# EAGLE design VOC_Interface (EAGLE 7.5.0)
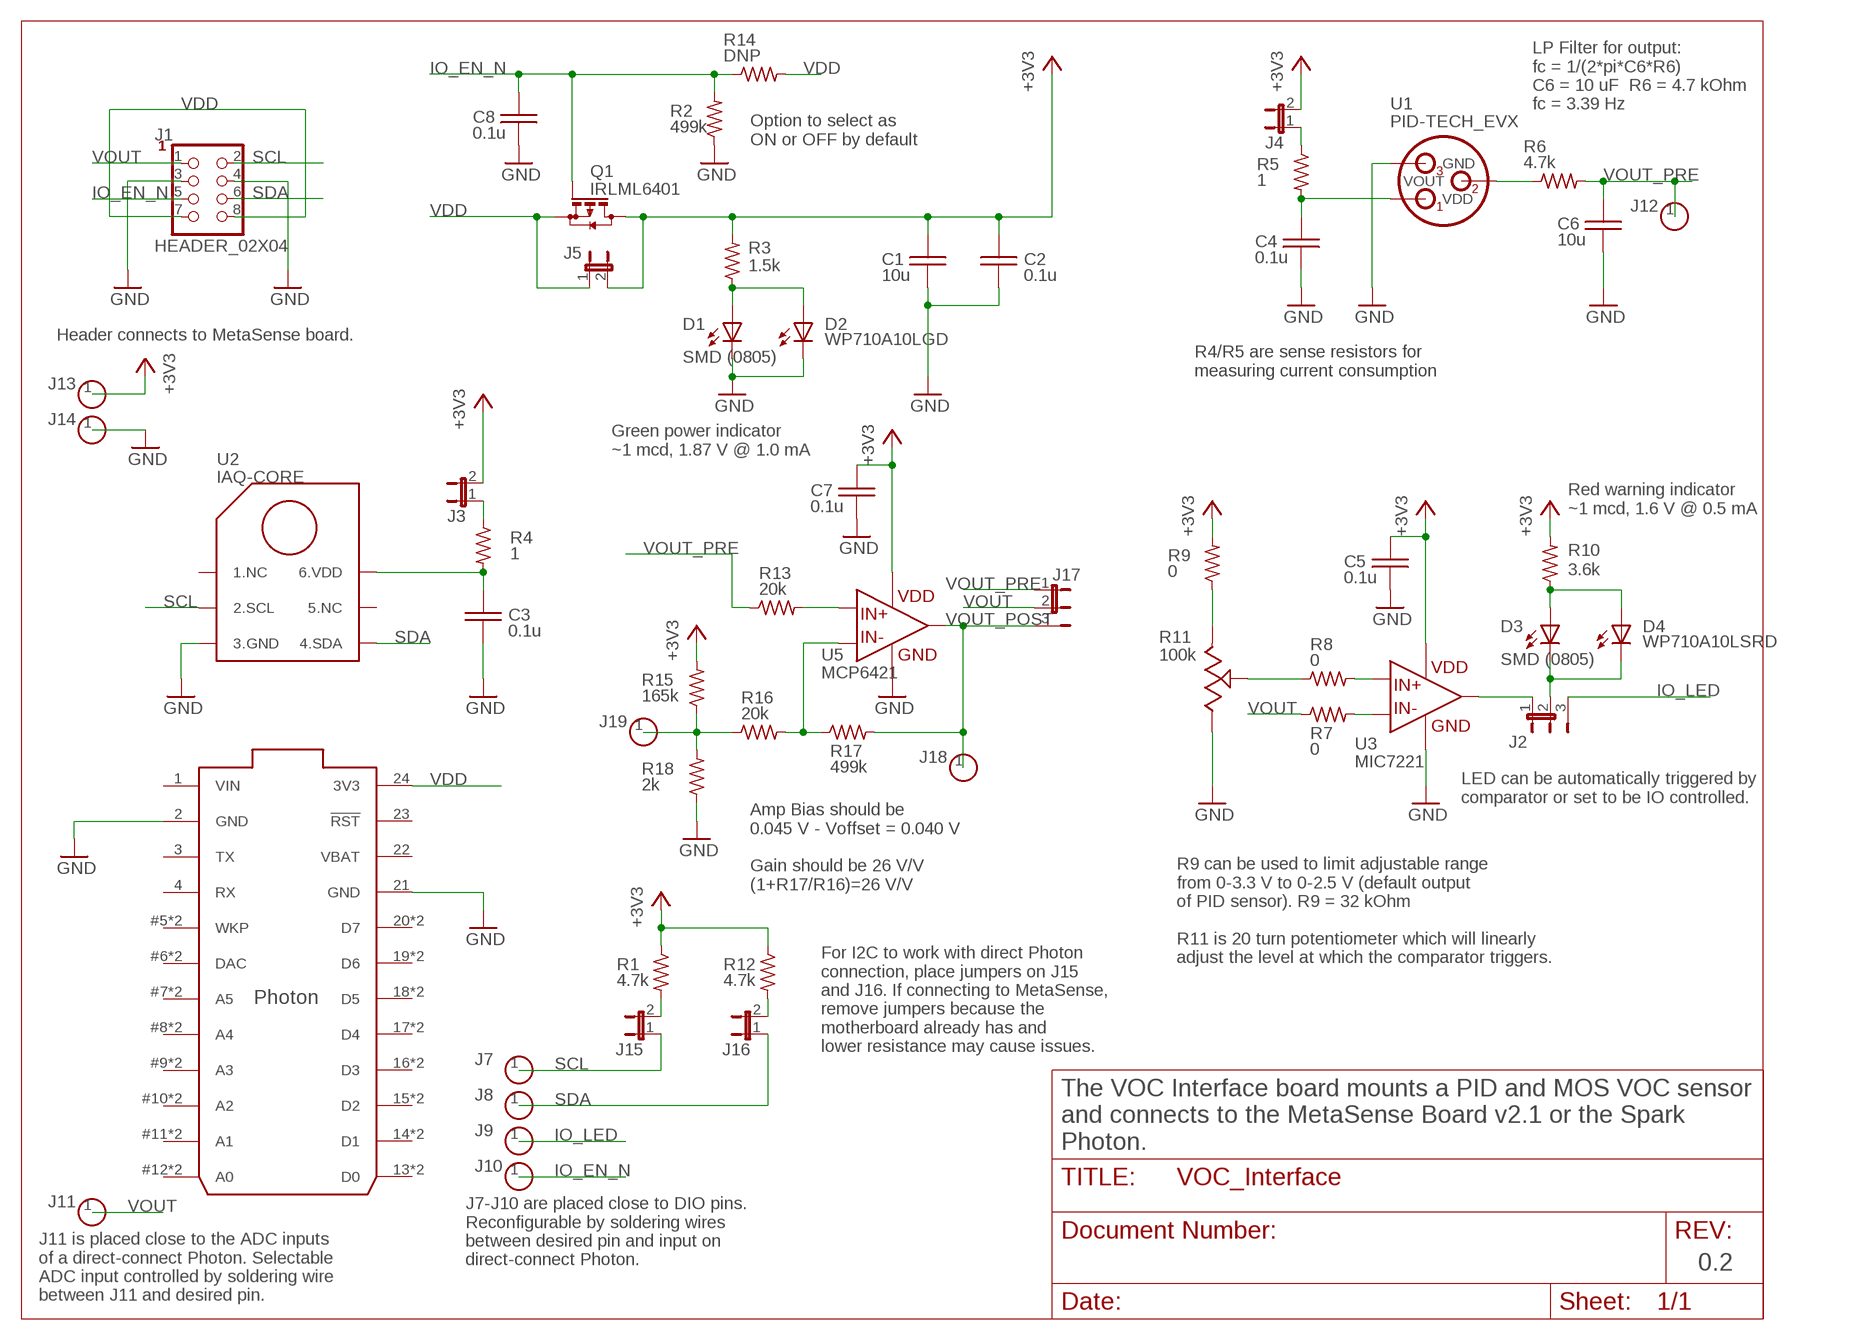
[diagram p0: schematic, sheet 1]

## Parts
C1  10u  C0805  [C0805]
C2  0.1u  C0805  [C0805]
C3  0.1u  C0805  [C0805]
C4  0.1u  C0805  [C0805]
C5  0.1u  C0805  [C0805]
C6  10u  C0805  [C0805]
C7  0.1u  C0805  [C0805]
C8  0.1u  C0805  [C0805]
D1  SMD (0805)  LEDSMD_0805  [CHIPLED_0805]
D2  WP710A10LGD  LEDTH_3MM  [LED3MM]
D3  SMD (0805)  LEDSMD_0805  [CHIPLED_0805]
D4  WP710A10LSRD  LEDTH_3MM  [LED3MM]
J1  HEADER_02X04  [2X04]
J2  HEADER_01X03  [1X03]
J3  HEADER_01X02  [1X02]
J4  HEADER_01X02  [1X02]
J5  HEADER_01X02  [1X02]
J7  HEADER_01X01  [1X01]
J8  HEADER_01X01  [1X01]
J9  HEADER_01X01  [1X01]
J10  HEADER_01X01  [1X01]
J11  HEADER_01X01  [1X01]
J12  HEADER_01X01  [1X01]
J13  HEADER_01X01  [1X01]
J14  HEADER_01X01  [1X01]
J15  HEADER_01X02  [1X02]
J16  HEADER_01X02  [1X02]
J17  HEADER_01X03  [1X03]
J18  HEADER_01X01  [1X01]
J19  HEADER_01X01  [1X01]
Q1  IRLML6401  BSS84  [SOT23]
R1  4.7k  R0805  [R0805]
R2  499k  R0805  [R0805]
R3  1.5k  R0805  [R0805]
R4  1  R0805  [R0805]
R5  1  R0805  [R0805]
R6  4.7k  R0805  [R0805]
R7  0  R0805  [R0805]
R8  0  R0805  [R0805]
R9  0  R0805  [R0805]
R10  3.6k  R0805  [R0805]
R11  100k  POT  [POTTRIM_TOP]
R12  4.7k  R0805  [R0805]
R13  20k  R0805  [R0805]
R14  DNP  R0805  [R0805]
R15  165k  R0805  [R0805]
R16  20k  R0805  [R0805]
R17  499k  R0805  [R0805]
R18  2k  R0805  [R0805]
U1  PID-TECH_EVX  [VOC_PID_3SOCKET]
U2  IAQ-CORE  [IAQ-CORE]
U3  MIC7221  [SOT-23-5]
U4  PHOTON  [PHOTON_STACKABLE]
U5  MCP6421  [SOT-23-5]

## Nets
+3V3: C1.2 C2.2 C5.2 C7.2 J3.2 J4.2 J5.2 J13.1 Q1.3(D) R1.1 R3.2 R9.2 R10.2 R12.1 R15.2 U3.2(2.VDD) U5.5(2.VDD)
AMP_IN+: R13.2 U5.3(3.IN+)
AMP_IN-: R16.2 R17.1 U5.4(4.IN-)
AMP_VBIAS: J19.1 R15.1 R16.1 R18.2
GND: C1.1 C2.1 C3.1 C4.1 C5.1 C6.1 C7.1 C8.1 D1.C D2.C J1.3 J1.4 J14.1 R2.1 R11.3 R18.1 U1.3_GND(GND) U2.3(3.GND) U3.5(5.GND) U4.2(GND) U4.21(GND) U5.2(5.GND)
IO_EN_N: C8.2 J1.5 J10.1 Q1.1(G) R2.2 R14.1
IO_LED: J2.3 J9.1
N$1: J2.1 U3.1(1.VOUT)
N$2: D3.C D4.C J2.2
N$4: D1.A D2.A R3.1
N$5: D3.A D4.A R10.1
N$7: R9.1 R11.1
N$8: R8.1 R11.2
N$9: J3.1 R4.1
N$10: J4.1 R5.1
N$11: J16.2 R12.2
N$13: J15.2 R1.2
N$27: R8.2 U3.3(3.IN+)
N$32: R7.2 U3.4(4.IN-)
SCL: J1.2 J7.1 J15.1 U2.2(2.SCL)
SDA: J1.6 J8.1 J16.1 U2.4(4.SDA)
VDD: J1.7 J1.8 J5.1 Q1.2(S) R14.2 U4.24(3V3)
VDD_MOS: C3.2 R4.2 U2.6(6.VDD)
VDD_PID: C4.2 R5.2 U1.1_VDD(VDD)
VOUT: J1.1 J11.1 J17.2 R7.1
VOUT_POST: J17.3 J18.1 R17.2 U5.1(1.VOUT)
VOUT_PRE: C6.2 J12.1 J17.1 R6.2 R13.1
VVOC: R6.1 U1.2_VOUT(VOUT)
Unconnected: U2.1(1.NC) U2.5(5.NC) U4.3(TX) U4.4(RX) U4.5(WKP) U4.6(DAC) U4.7(A5) U4.8(A4) U4.9(A3) U4.10(A2) U4.11(A1) U4.12(A0) U4.13(D0) U4.14(D1) U4.15(D2) U4.16(D3) U4.17(D4) U4.18(D5) U4.19(D6) U4.20(D7) U4.23(!RST) U4.#5(WKP) U4.#6(DAC) U4.#7(A5) U4.#8(A4) U4.#9(A3) U4.#10(A2) U4.#11(A1) U4.#12(A0) U4.@13(D0) U4.@14(D1) U4.@15(D2) U4.@16(D3) U4.@17(D4) U4.@18(D5) U4.@19(D6) U4.@20(D7)

## Notes on the sheet
- LP Filter for output:
  fc = 1/(2*pi*C6*R6)
  C6 = 10 uF  R6 = 4.7 kOhm
  fc = 3.39 Hz
- Option to select as 
  ON or OFF by default
- Header connects to MetaSense board.
- R4/R5 are sense resistors for 
  measuring current consumption
- Green power indicator
  ~1 mcd, 1.87 V @ 1.0 mA
- Red warning indicator
  ~1 mcd, 1.6 V @ 0.5 mA
- Amp Bias should be
  0.045 V - Voffset = 0.040 V
  
  Gain should be 26 V/V
  (1+R17/R16)=26 V/V
- LED can be automatically triggered by 
  comparator or set to be IO controlled.
- R9 can be used to limit adjustable range
  from 0-3.3 V to 0-2.5 V (default output 
  of PID sensor). R9 = 32 kOhm
  
  R11 is 20 turn potentiometer which will linearly
  adjust the level at which the comparator triggers.
- For I2C to work with direct Photon
  connection, place jumpers on J15
  and J16. If connecting to MetaSense,
  remove jumpers because the
  motherboard already has and
  lower resistance may cause issues.
- The VOC Interface board mounts a PID and MOS VOC sensor 
  and connects to the MetaSense Board v2.1 or the Spark 
  Photon.
- J7-J10 are placed close to DIO pins.
  Reconfigurable by soldering wires
  between desired pin and input on
  direct-connect Photon.
- 0.2
- J11 is placed close to the ADC inputs
  of a direct-connect Photon. Selectable
  ADC input controlled by soldering wire 
  between J11 and desired pin.

## Power pins joined to a net without a drawn wire
VBAT: U4.22(VBAT)
VIN: U4.1(VIN)

## Library data of the parts
C1-C8 = SEELAB:C
D1-D4 = SEELAB:LED
J1 = SEELAB:HEADER_02X04
J2 J17 = SEELAB:HEADER_01X03
J3-J5 J15 J16 = SEELAB:HEADER_01X02
J7-J14 J18 J19 = SEELAB:HEADER_01X01
Q1 = transistor-small-signal:BSS84: P-CHANNEL MOS FET
R1-R10 R12-R18 = SEELAB:R
R11 = SEELAB:POT
U1 = SEELAB:PID-TECH_EVX: PID VOC Sensor Mocon piD-TECH eVx for detecting TVOC concentration. Millmax 0363-0-15-80-23-27-10-0 mounts into holes.
U2 = SEELAB:IAQ-CORE
U3 = SEELAB:MIC7221: MIC7221 Comparator Low-cost, Rail-to-rail comparator, VDD = 2.2 - 10 V, Iq = 7 uA at VDD = 5.0 V, current sink output (> 100 mA). MIC7211 is push/pull output.
U4 = SEELAB:PHOTON
U5 = SEELAB:MCP6421

## Board
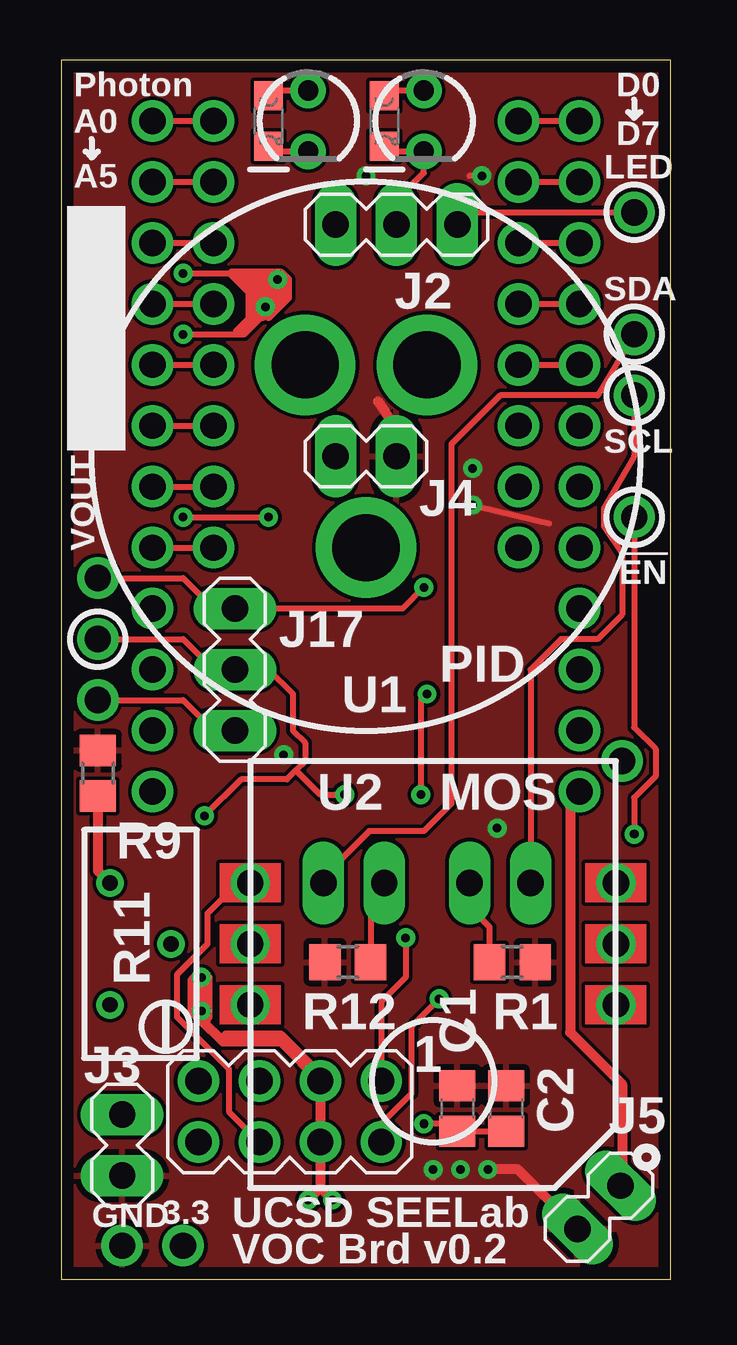
[diagram p1: board, top side]
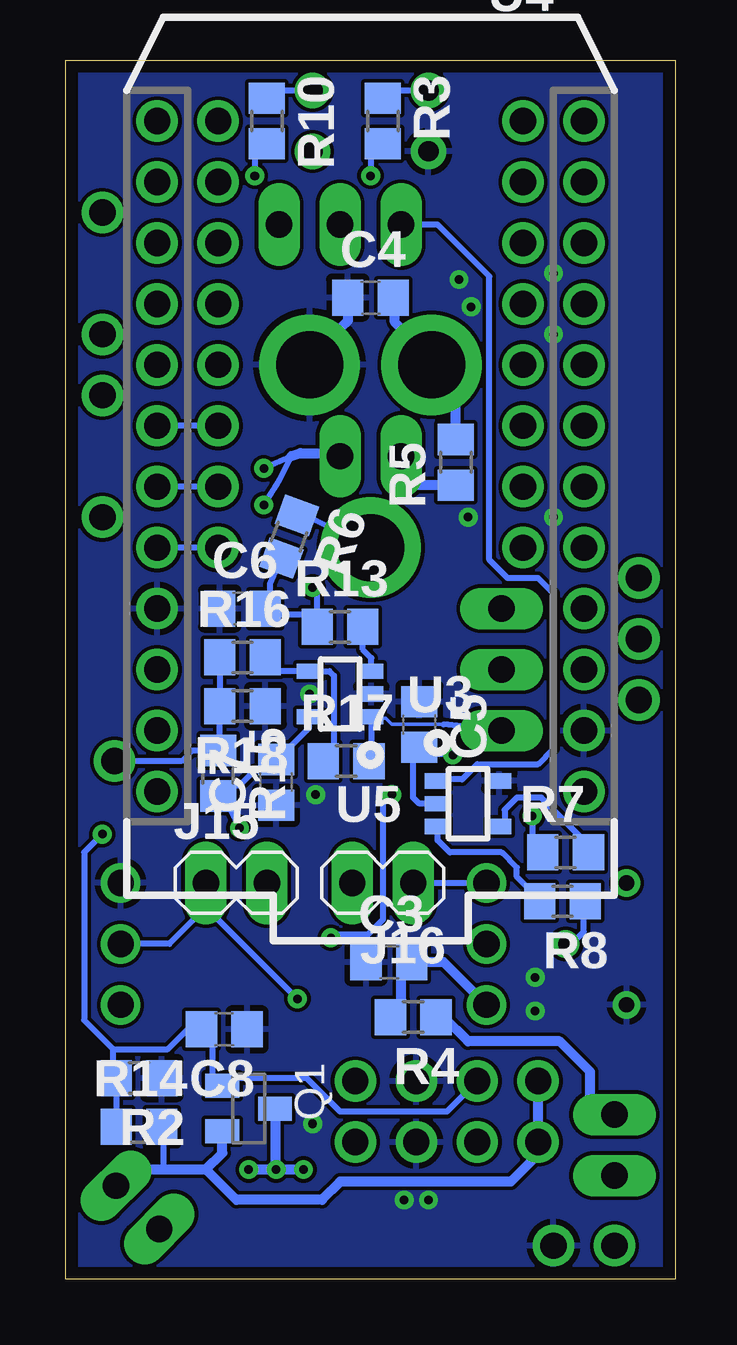
[diagram p2: board, bottom side, seen from below]

Size 25.4 x 50.8 mm. Coordinates in mm from the lower left corner, seen from the top.
Outline: 0,0 25.4,0 25.4,50.8 0,50.8 0,0
Copper layers (1*16): Top 0.0178mm / dielectric 59mil / Bottom 0.0178mm
Design rules "SSC-EAGLE-2Lyr_v1.0.0.3": minimum track width 6mil, minimum drill 14mil, track to track 6mil, track to pad 6mil, pad to pad 6mil, via to via 6mil, smd to smd 6mil, copper to edge 20mil, drill to drill 16mil, minimum pad ring 8mil, minimum via ring 8mil, stop-mask expansion 3mil, vias tented up to drill 0mil, thermal gap 10mil

### Footprints (pad centres in the part's own frame; a part is rotated, then mirrored left to right if it is on the bottom)
C0805 = smd 1.3 x 1.5: 1 -0.95,0; 2 0.95,0
CHIPLED_0805 = smd 1.2 x 1.2: A -1.05,0; C 1.05,0
LED3MM = drill 0.838 pad 1.473: A -1.27,0; C 1.27,0
2X04 = drill 1.097 pad 1.727: 1 -3.81,-1.27; 2 -3.81,1.27; 3 -1.27,-1.27; 4 -1.27,1.27; 5 1.27,-1.27; 6 1.27,1.27; 7 3.81,-1.27; 8 3.81,1.27
1X03 = drill 1.097 pad 1.727 long: 1 -2.54,0; 2 0,0; 3 2.54,0
1X02 = drill 1.097 pad 1.727 long: 1 -1.27,0; 2 1.27,0
1X01 = drill 1.097 pad 1.727: 1 0,0
SOT23 = smd 1 x 1.4: 1 -0.95,-1.1; 2 0.95,-1.1; 3 0,1.1
R0805 = smd 1.3 x 1.5: 1 -0.95,0; 2 0.95,0
POTTRIM_TOP = drill 0.635 pad 1.143: 1 1.27,-2.54; 2 -1.27,0; 3 1.27,2.54
VOC_PID_3SOCKET = drill 2.794 pad 3.81: 1_VDD -3.81,-2.54; 2_VOUT 3.81,0; 3_GND -3.81,2.54
IAQ-CORE = drill 1.092 pad 1.6: 1 -7.62,2.54; 2 -7.62,0; 3 -7.62,-2.54; 4 7.62,-2.54; 5 7.62,0; 6 7.62,2.54
SOT-23-5 = smd 0.635 x 1.016: 1 -0.95,-1.3; 2 0,-1.3; 3 0.95,-1.3; 4 0.95,1.3; 5 -0.95,1.3
PHOTON_STACKABLE = drill 1.097 pad 1.727: 1 1.27,32.258; 2 1.27,29.718; 3 1.27,27.178; 4 1.27,24.638; 5 1.27,22.098; 6 1.27,19.558; 7 1.27,17.018; 8 1.27,14.478; 9 1.27,11.938; 10 1.27,9.398; 11 1.27,6.858; 12 1.27,4.318; 13 19.05,4.318; 14 19.05,6.858; 15 19.05,9.398; 16 19.05,11.938; 17 19.05,14.478; 18 19.05,17.018; 19 19.05,19.558; 20 19.05,22.098; 21 19.05,24.638; 22 19.05,27.178; 23 19.05,29.718; 24 19.05,32.258; #5 3.81,22.098; #6 3.81,19.558; #7 3.81,17.018; #8 3.81,14.478; #9 3.81,11.938; #10 3.81,9.398; #11 3.81,6.858; #12 3.81,4.318; @13 16.51,4.318; @14 16.51,6.858; @15 16.51,9.398; @16 16.51,11.938; @17 16.51,14.478; @18 16.51,17.018; @19 16.51,19.558; @20 16.51,22.098

### Placement (x,y rotation side)
C1  16.51,7.11 90 top
C2  18.54,7.11 90 top
C3  11.94,13.21 0 bottom
C4  12.7,40.89 0 bottom
C5  10.67,23.11 270 bottom
C6  18.03,27.94 0 bottom
C7  16.64,20.7 90 bottom
C8  18.8,10.41 180 bottom
D1  8.64,48.26 270 top
D2  10.29,48.26 270 top
D3  13.46,48.26 270 top
D4  15.11,48.26 270 top
J1  9.53,6.99 180 top
J2  13.97,43.94 0 top
J3  2.54,5.59 270 top
J4  12.7,34.29 0 top
J5  22.4,3 225 top
J7  23.88,36.83 0 top
J8  23.88,39.37 0 top
J9  23.88,44.45 0 top
J10  23.88,31.75 0 top
J11  1.52,26.67 0 top
J12  1.52,29.21 0 top
J13  2.54,1.4 0 top
J14  5.08,1.4 0 top
J15  18.29,16.51 0 bottom
J16  12.19,16.51 180 bottom
J17  7.24,25.4 270 top
J18  1.52,24.13 0 top
J19  23.37,21.59 0 top
Q1  17.78,7.11 270 bottom
R1  18.8,13.21 180 top
R2  22.35,8.38 180 bottom
R3  12.19,48.26 270 bottom
R4  10.92,10.92 180 bottom
R5  9.14,34.04 90 bottom
R6  16.09,30.94 250 bottom
R7  4.57,17.78 0 bottom
R8  4.7,15.75 180 bottom
R9  1.52,21.08 90 top
R10  17.02,48.26 270 bottom
R11  3.3,13.97 180 top
R12  11.94,13.21 0 top
R13  13.97,27.18 0 bottom
R14  22.35,6.35 0 bottom
R15  19.05,21.08 270 bottom
R16  18.03,25.91 0 bottom
R17  13.72,21.59 0 bottom
R18  18.03,23.88 180 bottom
U1  12.7,34.29 270 top
U2  15.49,13.97 180 top
U3  8.64,19.81 270 bottom
U4  2.54,52.58 180 bottom
U5  13.97,24.38 90 bottom

### Tracks (layer width: path | path; a pad name or v marks a point on that pad's centre or on a via)
+3V3  (via drill 0.36 pad 0.79)
  Top 0.254: v9.27,21.84 9.14,21.72 | v17.14,32.26 20.32,31.5 | v12.7,45.97 12.45,45.97 | v17.53,45.97 17.02,45.97
  Top 0.406: v15.49,4.57 15.49,4.32 | J5.2 19.03,4.57 v17.78,4.57 | 13.21,36.58 13.72,35.81
  Bottom 0.254: 18.8,20.32 18.86,20.32 R15.2 18.54,19.62 v18.16,18.8 | 18.54,20.57 18.16,20.57 17.53,21.21 17.33,21.21 C7.2 16.83,21.4 15.27,22.96 U5.5 | v9.27,21.84 10.23,21.91 C5.2 10.92,21.91 10.92,20.07 10.67,19.81 U3.2 | 15.62,34.42 15.75,34.29 16,34.29 | R3.2 12.7,46.8 v12.7,45.97 | R10.2 17.53,47.06 v17.53,45.97 | v17.14,33.78 16,34.29 | v17.14,32.26 16.51,33.27 16,34.29
  Bottom 0.406: 18.8,20.32 18.54,20.57 | Q1.3 16.68,4.62 v16.64,4.57 | v16.64,4.57 v15.49,4.57 | v17.78,4.57 v16.64,4.57 | 16,34.29 15.62,34.42 14.1,34.42 J4.2
  pour Top: 0,50.8 25.4,50.8 25.4,0 0,0
AMP_IN+
  Bottom 0.254: U5.3 12.67,25.88 13.02,26.23 R13.2
AMP_IN-
  Bottom 0.254: R16.2 16.51,25.33 U5.4 14.41,25.33 14.22,25.15 14.22,22.03 R17.1
AMP_VBIAS
  Bottom 0.254: R16.1 R18.2 18.98,22.03 R15.1 20.13,22.03 20.57,21.59 J19.1
GND  (via drill 0.36 pad 0.79)
  Top 0.254: v5.08,41.91 7.11,41.91 8.76,41.91 v9.02,41.66 | v5.08,39.37 7.62,39.37 8.38,40.13 v8.51,40.51 | v15.11,6.48 16.32,6.48 C1.1 C2.1 | v15.24,24.38 14.99,24.13 v14.99,20.19 | D1.C 8.86,46.99 D2.C | v5.08,31.75 v8.64,31.75
  Top 0.406: 8.38,40.13 8.38,41.4 8.89,41.91 | 8.89,41.91 9.14,41.91 9.4,41.66 9.4,40.89 8.64,40.13 | 7.37,39.5 7.87,40.01 7.87,41.15 7.11,41.91 8.89,41.91 | 5.84,12.7 5.71,12.7 5.46,12.45 5.46,11.18 5.84,10.79 | 5.84,12.45 v5.84,11.18 5.84,10.79 | 5.84,10.79 6.73,9.91 9.14,9.91 J1.3 | 5.84,10.79 5.97,10.79 6.1,10.92 6.1,12.57 5.97,12.7 | 10.92,8.38 10.79,8.38 J1.4 10.79,3.81 | 10.79,3.81 v11.3,3.3 | v10.29,3.3 10.79,3.81
  Bottom 0.254: v15.11,6.48 15.11,6.22
  Bottom 0.406: C4.1 13.65,39.94 14.73,38.86 14.73,38.61 U1.3_GND
  other vias: 5.84,12.57
  pour Bottom: 0,50.8 25.4,50.8 25.4,0 0,0
IO_EN_N  (via drill 0.36 pad 0.79)
  Top 0.254: J10.1 23.88,22.99 24.77,22.1 24.77,20.95 23.88,20.07 v23.88,18.54
  Bottom 0.254: Q1.1 18.95,8.13 | Q1.1 18.73,8.06 18.41,8.38 15.37,8.38 13.97,6.99 9.53,6.99 J1.5 | Q1.1 18.98,8.06 19.3,8.38 19.3,10.23 C8.2 20.32,10.41 21.15,9.59 23.43,9.59 | v23.88,18.54 24.64,17.78 24.64,10.79 23.43,9.59 | 23.43,9.59 23.43,8.51 R2.2 R14.1
IO_LED
  Top 0.254: J2.3 17.02,44.45 J9.1
N$1
  Bottom 0.254: J2.1 9.91,43.94 7.75,41.78 7.75,29.97 6.99,29.21 5.71,29.21 5.08,28.57 5.08,22.1 5.71,21.46 8.26,21.46 8.89,20.83 9.87,20.83 U3.1
N$2
  Top 0.254: D3.C 13.68,46.99 D4.C 15.11,46.1 13.97,44.96 J2.2
N$3
  Top 0.254: 4.57,48.26 5.59,48.26
N$4
  Top 0.254: D1.A 8.86,49.53 D2.A
  Bottom 0.254: R3.1 11.87,49.53 D2.A
N$5
  Top 0.254: D3.A 13.68,49.53 D4.A
  Bottom 0.254: R10.1 16.7,49.53 D4.A
N$6
  Top 0.254: 4.57,45.72 5.59,45.72
N$7
  Top 0.406: R9.1 1.52,17.02 R11.1
N$8
  Bottom 0.254: R11.2 4.32,13.97 3.81,14.48 3.81,15.69 R8.1
N$9
  Bottom 0.406: J3.1 2.79,7.11 3.56,7.11 3.56,8.64 4.83,9.91 8.64,9.91 9.65,10.92 R4.1
N$10
  Bottom 0.406: R5.1 10.99,33.09 11.43,33.53 J4.1
N$11
  Top 0.254: J16.2 12.89,16.19 R12.2
N$12
  Top 0.254: 4.57,43.18 5.59,43.18
N$13
  Top 0.254: R1.2 17.85,14.67 17.02,15.49 J15.2
N$14
  Top 0.254: 4.57,40.64 5.59,40.64
N$15
  Top 0.254: 4.57,38.1 5.59,38.1
N$16
  Top 0.254: 4.57,35.56 5.59,35.56
N$17
  Top 0.254: 4.57,30.48 5.59,30.48
N$18
  Top 0.254: 4.57,33.02 5.59,33.02
N$19
  Top 0.254: 19.81,48.26 20.83,48.26
N$20
  Top 0.254: 19.81,45.72 20.83,45.72
N$21
  Top 0.254: 19.81,43.18 20.83,43.18
N$22
  Top 0.254: 19.81,40.64 20.83,40.64
N$23
  Top 0.254: 19.81,38.1 20.83,38.1
N$24
  Bottom 0.254: 19.81,35.56 20.83,35.56
N$25
  Bottom 0.254: 19.81,33.02 20.83,33.02
N$26
  Bottom 0.254: 19.81,30.48 20.83,30.48
N$27
  Bottom 0.254: R8.2 5.65,15.81 6.6,16.76 6.6,17.14 7.24,17.78 9.4,17.78 9.91,18.29 9.91,18.83 U3.3
N$28
  Top 0.406: 6.86,10.16 9.14,10.16 10.92,8.38
N$29
  Top 0.406: 9.14,41.66 9.14,41.15 8.64,40.64 8.64,41.15 9.02,41.53
N$30
  Top 0.406: 7.62,41.66 8.38,41.66
N$31
  Top 0.406: 7.87,41.4 8.13,41.4 8.13,40.13
N$32
  Bottom 0.254: R7.2 3.62,18.1 5.59,20.07 6.6,20.07 7.11,19.56 7.11,19.09 U3.4
SCL  (via drill 0.36 pad 0.79)
  Top 0.254: J7.1 23.88,34.29 22.61,32.13 22.61,31.37 23.37,30.23 23.37,27.69 22.35,26.67 20.83,26.67 19.56,25.4 19.56,17.78 19.43,17.4 19.43,17.14 19.56,17.02 | 19.56,17.65 19.56,17.02 | 19.56,17.02 J15.1 | J1.2 13.34,6.48 14.61,7.75 14.61,10.54 v15.75,11.68
  Bottom 0.254: J15.1 19.56,15.49 | 19.56,15.49 21.08,13.97 U2.2 | v15.75,11.68 19.56,15.49
SDA
  Top 0.254: U2.4 7.37,16.51 6.1,15.24 6.1,13.97 4.83,12.7 4.83,10.92 6.99,8.76 6.99,6.99 J1.6 | J8.1 22.35,36.83 18.29,36.83 16.26,34.8 16.26,19.81 15.11,18.67 12.83,18.67 11.43,17.27 11.43,17.02 J16.1
  Bottom 0.254: J16.1 U2.4
VDD
  Top 0.406: U4.24 21.21,19.68 21.21,10.29 23.37,8.13 23.37,3.83 J5.1
  Bottom 0.254: R14.2 21.34,6.28 21.34,4.57
  Bottom 0.406: J5.1 22.62,4.57 21.34,4.57 19.56,4.57 | 19.56,4.57 18.88,5.25 Q1.2 | 19.56,4.57 18.29,3.3 14.73,3.3 13.97,4.06 6.86,4.06 5.71,5.21 J1.8 J1.7
VDD_MOS
  Bottom 0.406: U2.6 9.65,13.21 C3.2 11.24,12.89 11.43,12.57 11.43,11.49 R4.2
VDD_PID
  Bottom 0.406: R5.2 9.14,36.58 9.65,37.08 9.65,37.59 U1.1_VDD 10.16,38.35 11.68,39.88 11.68,40.83 C4.2
VOUT  (via drill 0.36 pad 0.79)
  Top 0.254: J11.1 5.08,26.67 6.35,25.4 J17.2 8.64,25.4 9.65,24.38 9.65,22.86 10.16,22.35 10.16,21.59 9.78,21.21 | v5.97,19.3 7.49,20.83 9.4,20.83 9.78,21.21 | 9.78,21.21 10.79,20.19 v11.81,20.19 | v14.35,14.22 14.35,12.57 13.34,11.56 J1.1
  Bottom 0.254: v5.97,19.3 5.97,17.85 R7.1 | v11.81,20.19 12.19,19.81 12.19,14.99 12.83,14.35 14.22,14.35 v14.35,14.22
VOUT_POST
  Top 0.254: J18.1 5.08,24.13 6.35,22.86 J17.3
  Bottom 0.152: 9.65,23.11 11.81,23.11 12.06,23.37 12.6,23.37 U5.1
  Bottom 0.254: U5.1 12.67,21.69 R17.2 | J17.3 9.65,23.11
VOUT_PRE  (via drill 0.36 pad 0.79)
  Top 0.254: v15.11,28.83 14.22,27.94 J17.1 6.35,27.94 5.08,29.21 J12.1
  Bottom 0.254: v15.11,28.83 14.92,28.64 R13.1 15.43,27.69 16.76,27.69 17.02,27.94 C6.2 16.89,28.45 16.89,28.96 R6.2
VVOC
  Bottom 0.254: U1.2_VOUT 13.21,30.99 13.72,30.99 | 13.72,30.99 13.97,30.99 | R6.1 15.69,31.75 15.24,31.75 13.72,30.99

### Text on the board
tPlace: Photon | D0 | A0 | D7 | LED | A5 | SDA | SCL | VOUT | !EN | PID | MOS | GND | 3.3 | UCSD SEELab | VOC Brd v0.2